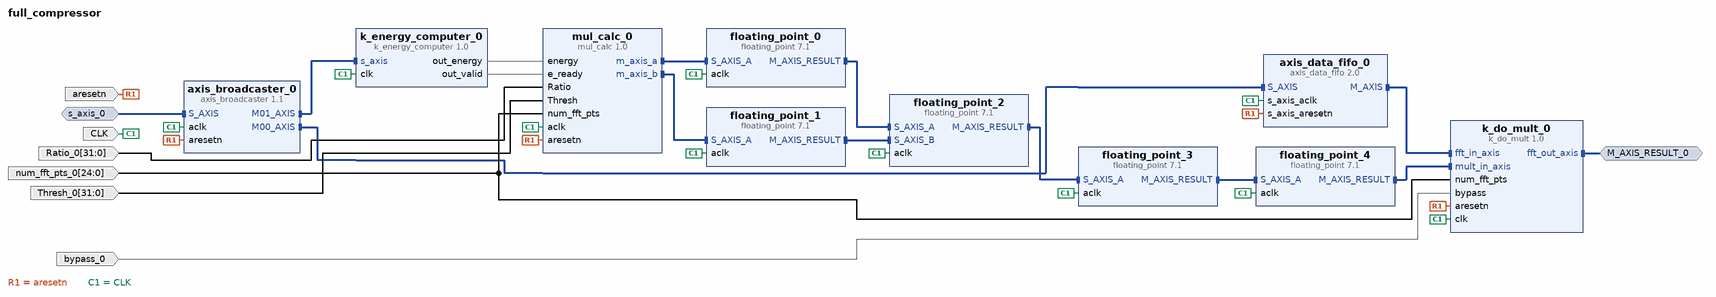
[diagram p0: block diagram of the top level]
# Vivado block design full_compressor, xc7z020clg484-1, Vivado 2020.2
create_bd_design full_compressor

create_bd_intf_port -mode Master -vlnv xilinx.com:interface:axis_rtl:1.0 M_AXIS_RESULT_0
create_bd_intf_port -mode Slave -vlnv xilinx.com:interface:axis_rtl:1.0 s_axis_0
set_property -dict [list \
  CONFIG.HAS_TKEEP 0 \
  CONFIG.HAS_TLAST 0 \
  CONFIG.HAS_TREADY 1 \
  CONFIG.HAS_TSTRB 0 \
  CONFIG.LAYERED_METADATA undef \
  CONFIG.TDATA_NUM_BYTES 4 \
  CONFIG.TDEST_WIDTH 0 \
  CONFIG.TID_WIDTH 0 \
  CONFIG.TUSER_WIDTH 0 \
] [get_bd_intf_ports s_axis_0]
create_bd_port -dir I -type clk CLK
set_property -dict {CONFIG.FREQ_HZ 100000000} [get_bd_ports CLK]
create_bd_port -dir I -type rst aresetn
create_bd_port -dir I -from 24 -to 0 num_fft_pts_0
create_bd_port -dir I -from 31 -to 0 Ratio_0
create_bd_port -dir I -from 31 -to 0 Thresh_0
create_bd_port -dir I bypass_0

create_bd_cell -type ip -vlnv xilinx.com:ip:floating_point:7.1 floating_point_0
set_property -dict [list \
  CONFIG.A_Precision_Type Int32 \
  CONFIG.C_A_Exponent_Width 32 \
  CONFIG.C_A_Fraction_Width 0 \
  CONFIG.C_Accum_Input_Msb 32 \
  CONFIG.C_Accum_Lsb -31 \
  CONFIG.C_Accum_Msb 32 \
  CONFIG.C_Latency 7 \
  CONFIG.C_Mult_Usage No_Usage \
  CONFIG.C_Rate 1 \
  CONFIG.C_Result_Exponent_Width 8 \
  CONFIG.C_Result_Fraction_Width 24 \
  CONFIG.Operation_Type Fixed_to_float \
  CONFIG.Result_Precision_Type Single \
] [get_bd_cells floating_point_0]
create_bd_cell -type ip -vlnv xilinx.com:ip:floating_point:7.1 floating_point_1
set_property -dict [list \
  CONFIG.A_Precision_Type Int32 \
  CONFIG.C_Accum_Input_Msb 32 \
  CONFIG.C_Accum_Lsb -31 \
  CONFIG.C_Accum_Msb 32 \
  CONFIG.C_Latency 7 \
  CONFIG.C_Mult_Usage No_Usage \
  CONFIG.C_Rate 1 \
  CONFIG.C_Result_Exponent_Width 8 \
  CONFIG.C_Result_Fraction_Width 24 \
  CONFIG.Operation_Type Fixed_to_float \
  CONFIG.Result_Precision_Type Single \
] [get_bd_cells floating_point_1]
create_bd_cell -type ip -vlnv xilinx.com:ip:floating_point:7.1 floating_point_2
set_property -dict [list \
  CONFIG.C_Latency 29 \
  CONFIG.C_Mult_Usage No_Usage \
  CONFIG.C_Rate 1 \
  CONFIG.C_Result_Exponent_Width 8 \
  CONFIG.C_Result_Fraction_Width 24 \
  CONFIG.Operation_Type Divide \
  CONFIG.Result_Precision_Type Single \
] [get_bd_cells floating_point_2]
create_bd_cell -type ip -vlnv xilinx.com:ip:floating_point:7.1 floating_point_3
set_property -dict [list \
  CONFIG.C_Latency 29 \
  CONFIG.C_Mult_Usage No_Usage \
  CONFIG.C_Rate 1 \
  CONFIG.C_Result_Exponent_Width 8 \
  CONFIG.C_Result_Fraction_Width 24 \
  CONFIG.Operation_Type Square_root \
  CONFIG.Result_Precision_Type Single \
] [get_bd_cells floating_point_3]
create_bd_cell -type ip -vlnv xilinx.com:ip:floating_point:7.1 floating_point_4
set_property -dict [list \
  CONFIG.C_Accum_Input_Msb 32 \
  CONFIG.C_Accum_Lsb -31 \
  CONFIG.C_Accum_Msb 32 \
  CONFIG.C_Latency 7 \
  CONFIG.C_Mult_Usage No_Usage \
  CONFIG.C_Rate 1 \
  CONFIG.C_Result_Exponent_Width 2 \
  CONFIG.C_Result_Fraction_Width 8 \
  CONFIG.Operation_Type Float_to_fixed \
  CONFIG.Result_Precision_Type Custom \
] [get_bd_cells floating_point_4]
create_bd_cell -type ip -vlnv sfu.ca:user:k_energy_computer:1.0 k_energy_computer_0
create_bd_cell -type ip -vlnv xilinx.com:ip:axis_broadcaster:1.1 axis_broadcaster_0
create_bd_cell -type ip -vlnv xilinx.com:ip:axis_data_fifo:2.0 axis_data_fifo_0
set_property -dict {CONFIG.FIFO_DEPTH 2048} [get_bd_cells axis_data_fifo_0]
create_bd_cell -type ip -vlnv sfu.ca:user:mul_calc:1.0 mul_calc_0
create_bd_cell -type ip -vlnv sfu.ca:user:k_do_mult:1.0 k_do_mult_0

# ---- connections ----

connect_bd_intf_net [get_bd_intf_pins mul_calc_0/m_axis_b] [get_bd_intf_pins floating_point_1/S_AXIS_A]
connect_bd_intf_net [get_bd_intf_pins mul_calc_0/m_axis_a] [get_bd_intf_pins floating_point_0/S_AXIS_A]
connect_bd_intf_net [get_bd_intf_pins floating_point_4/M_AXIS_RESULT] [get_bd_intf_pins k_do_mult_0/mult_in_axis]
connect_bd_intf_net [get_bd_intf_ports M_AXIS_RESULT_0] [get_bd_intf_pins k_do_mult_0/fft_out_axis]
connect_bd_intf_net [get_bd_intf_pins floating_point_1/M_AXIS_RESULT] [get_bd_intf_pins floating_point_2/S_AXIS_B]
connect_bd_intf_net [get_bd_intf_pins floating_point_0/M_AXIS_RESULT] [get_bd_intf_pins floating_point_2/S_AXIS_A]
connect_bd_intf_net [get_bd_intf_pins axis_data_fifo_0/M_AXIS] [get_bd_intf_pins k_do_mult_0/fft_in_axis]
connect_bd_intf_net [get_bd_intf_pins floating_point_2/M_AXIS_RESULT] [get_bd_intf_pins floating_point_3/S_AXIS_A]
connect_bd_intf_net [get_bd_intf_pins axis_broadcaster_0/M00_AXIS] [get_bd_intf_pins axis_data_fifo_0/S_AXIS]
connect_bd_intf_net [get_bd_intf_pins floating_point_3/M_AXIS_RESULT] [get_bd_intf_pins floating_point_4/S_AXIS_A]
connect_bd_intf_net -intf_net s_axis_0_1 [get_bd_intf_ports s_axis_0] [get_bd_intf_pins axis_broadcaster_0/S_AXIS]
connect_bd_intf_net [get_bd_intf_pins axis_broadcaster_0/M01_AXIS] [get_bd_intf_pins k_energy_computer_0/s_axis]
connect_bd_net -net aresetn_0_1 [get_bd_ports aresetn] \
  [get_bd_pins axis_broadcaster_0/aresetn] [get_bd_pins axis_data_fifo_0/s_axis_aresetn] [get_bd_pins mul_calc_0/aresetn] \
  [get_bd_pins k_do_mult_0/aresetn]
connect_bd_net -net clk_0_1 [get_bd_ports CLK] \
  [get_bd_pins floating_point_0/aclk] [get_bd_pins floating_point_1/aclk] [get_bd_pins floating_point_2/aclk] \
  [get_bd_pins floating_point_3/aclk] [get_bd_pins floating_point_4/aclk] [get_bd_pins k_energy_computer_0/clk] \
  [get_bd_pins axis_broadcaster_0/aclk] [get_bd_pins axis_data_fifo_0/s_axis_aclk] [get_bd_pins mul_calc_0/aclk] \
  [get_bd_pins k_do_mult_0/clk]
connect_bd_net [get_bd_pins k_energy_computer_0/out_energy] [get_bd_pins mul_calc_0/energy]
connect_bd_net [get_bd_pins k_energy_computer_0/out_valid] [get_bd_pins mul_calc_0/e_ready]
connect_bd_net -net num_fft_pts_0_1 [get_bd_ports num_fft_pts_0] [get_bd_pins mul_calc_0/num_fft_pts] [get_bd_pins k_do_mult_0/num_fft_pts]
connect_bd_net -net Ratio_0_1 [get_bd_ports Ratio_0] [get_bd_pins mul_calc_0/Ratio]
connect_bd_net -net Thresh_0_1 [get_bd_ports Thresh_0] [get_bd_pins mul_calc_0/Thresh]
connect_bd_net -net bypass_0_1 [get_bd_ports bypass_0] [get_bd_pins k_do_mult_0/bypass]

validate_bd_design
save_bd_design
